# EAGLE design stm32f401_test_module (EAGLE 6.4)
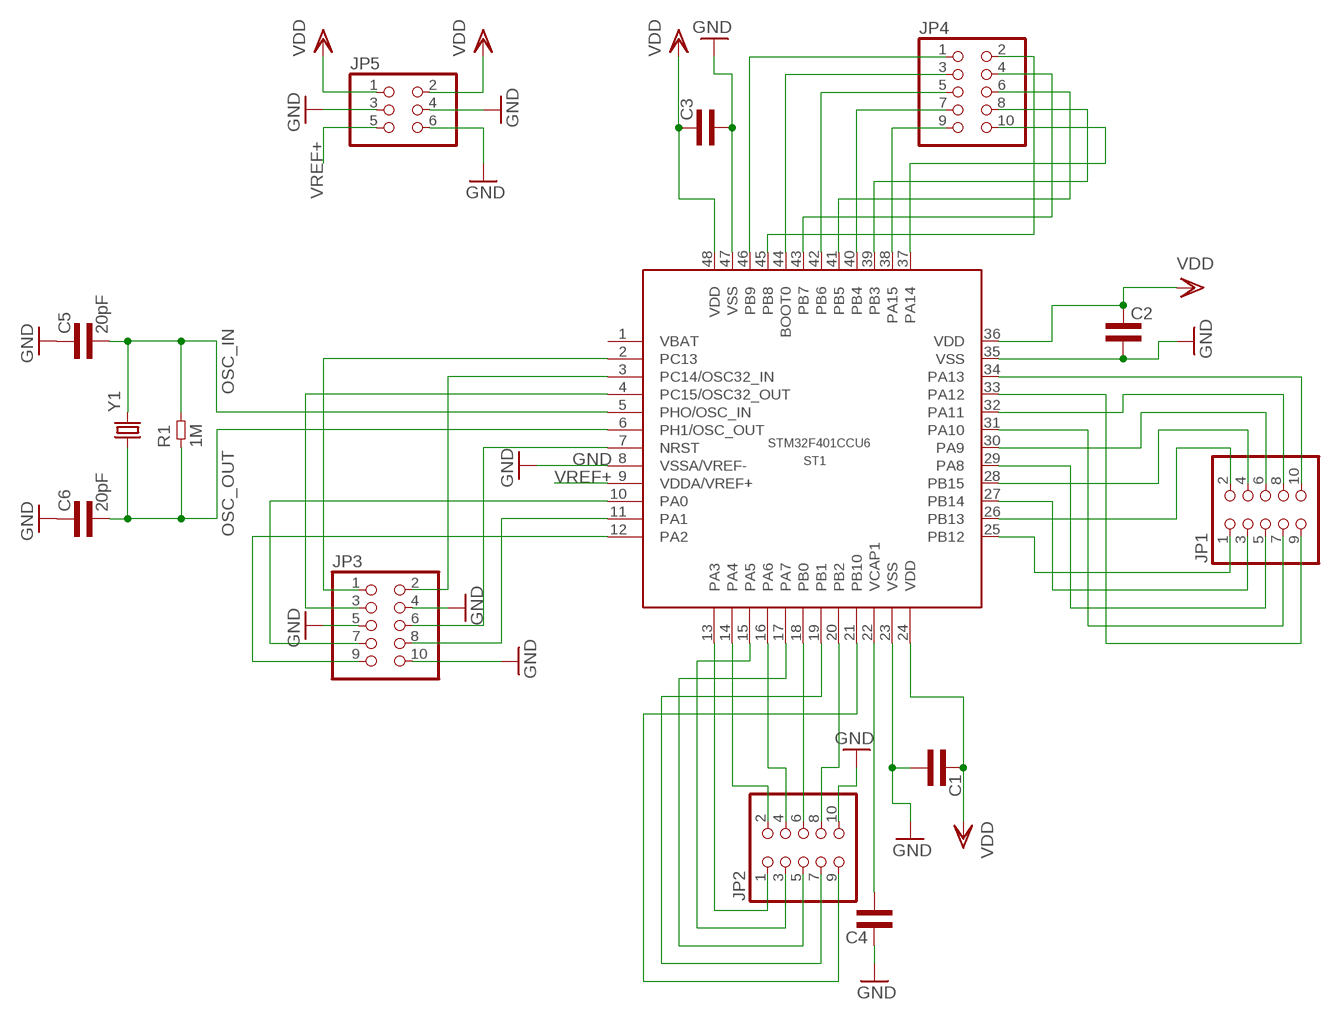
[diagram p0: schematic, sheet 1]

## Parts
C1  CAP0402L3  [0402L3]
C2  CAP0402L3  [0402L3]
C3  CAP0402L3  [0402L3]
C4  CAP0402L3  [0402L3]
C5  20pF  CAP0603L3  [0603L3]
C6  20pF  CAP0603L3  [0603L3]
JP1  PINHD-2X5  [2X05]
JP2  PINHD-2X5  [2X05]
JP3  PINHD-2X5  [2X05]
JP4  PINHD-2X5  [2X05]
JP5  PINHD-2X3  [2X03]
R1  1M  RES0603L3  [0603L3]
ST1  STM32F401CCU6  [UFQFPN48]
Y1  CRYSTALHC49US  [HC49US]

## Nets
GND: C1.P$2 C2.P$2 C3.P$2 C4.P$1 C5.P$1 C6.P$1 JP2.10 JP3.4 JP3.5 JP3.10 JP5.3 JP5.4 JP5.6 ST1.8(VSSA/VREF-) ST1.23(VSS) ST1.35(VSS) ST1.47(VSS)
N$1: JP2.7 ST1.19(PB1)
N$2: JP2.8 ST1.20(PB2)
N$3: JP2.9 ST1.21(PB10)
N$7: C4.P$2 ST1.22(VCAP1)
N$9: JP3.1 ST1.2(PC13)
N$10: JP3.2 ST1.3(PC14/OSC32_IN)
N$11: JP3.3 ST1.4(PC15/OSC32_OUT)
N$14: JP3.6 ST1.7(NRST)
N$15: JP3.7 ST1.10(PA0)
N$16: JP3.8 ST1.11(PA1)
N$17: JP3.9 ST1.12(PA2)
N$18: JP2.1 ST1.13(PA3)
N$19: JP2.2 ST1.14(PA4)
N$20: JP2.3 ST1.15(PA5)
N$21: JP2.4 ST1.16(PA6)
N$22: JP2.5 ST1.17(PA7)
N$23: JP2.6 ST1.18(PB0)
N$24: JP1.1 ST1.25(PB12)
N$25: JP1.2 ST1.26(PB13)
N$26: JP1.3 ST1.27(PB14)
N$27: JP1.4 ST1.28(PB15)
N$28: JP1.5 ST1.29(PA8)
N$29: JP1.6 ST1.30(PA9)
N$30: JP1.7 ST1.31(PA10)
N$31: JP1.8 ST1.32(PA11)
N$32: JP1.9 ST1.33(PA12)
N$33: JP1.10 ST1.34(PA13)
N$34: JP4.1 ST1.46(PB9)
N$35: JP4.2 ST1.45(PB8)
N$36: JP4.3 ST1.44(BOOT0)
N$37: JP4.4 ST1.43(PB7)
N$38: JP4.5 ST1.42(PB6)
N$39: JP4.6 ST1.41(PB5)
N$40: JP4.7 ST1.40(PB4)
N$41: JP4.8 ST1.39(PB3)
N$42: JP4.9 ST1.38(PA15)
N$43: JP4.10 ST1.37(PA14)
OSC_IN: C5.P$2 R1.P$2 ST1.5(PHO/OSC_IN) Y1.2
OSC_OUT: C6.P$2 R1.P$1 ST1.6(PH1/OSC_OUT) Y1.1
VDD: C1.P$1 C2.P$1 C3.P$1 JP5.1 JP5.2 ST1.24(VDD) ST1.36(VDD) ST1.48(VDD)
VREF+: JP5.5 ST1.9(VDDA/VREF+)
Unconnected: ST1.1(VBAT)

## Library data of the parts
C1-C6 = common:CAP
JP1-JP4 = pinhead:PINHD-2X5: PIN HEADER
JP5 = pinhead:PINHD-2X3: PIN HEADER
R1 = common:RES
ST1 = common:STM32F401CCU6
Y1 = SparkFun-FreqCtrl:CRYSTAL: Various standard crystals. Proven footprints. Spark Fun Electronics SKU : COM-00534

## Board
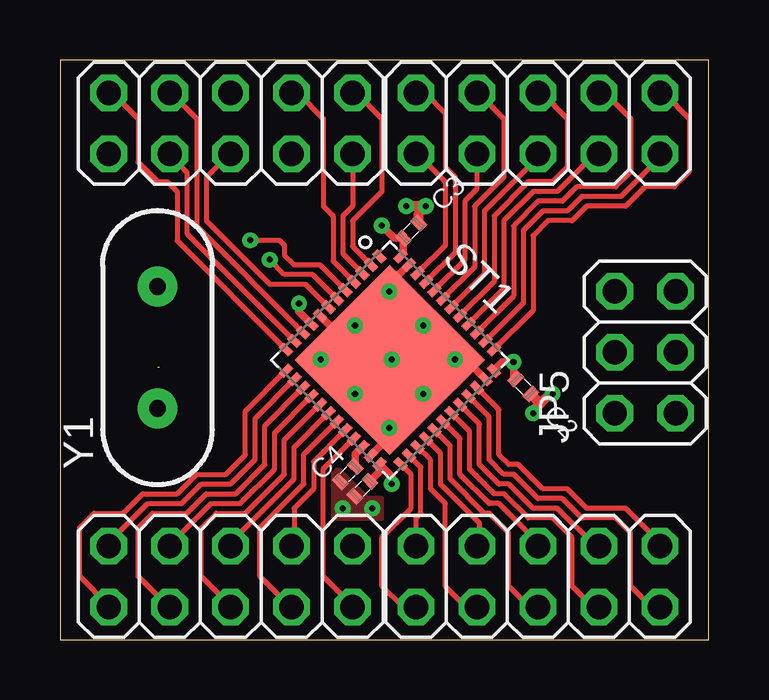
[diagram p1: board, top side]
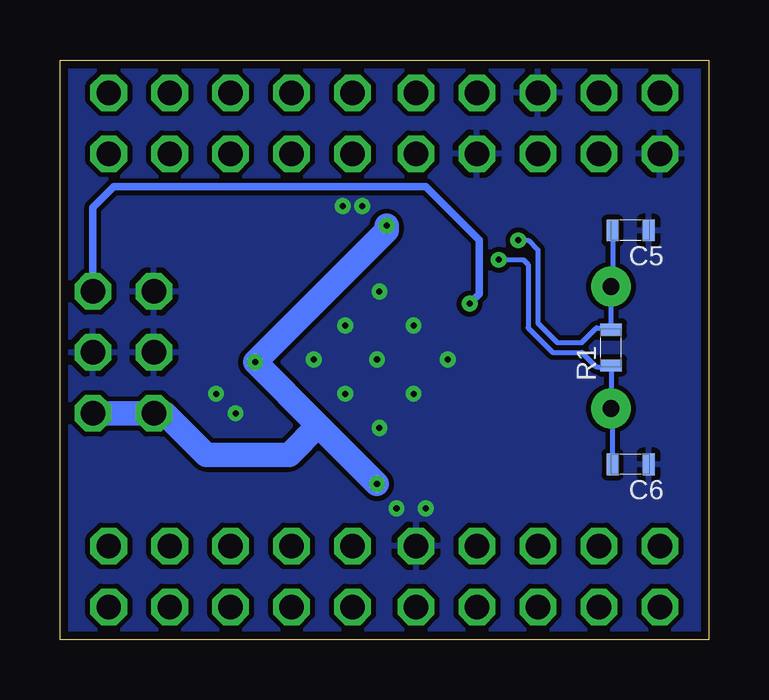
[diagram p2: board, bottom side, seen from below]

Size 27.03 x 24.18 mm. Coordinates in mm from the lower left corner, seen from the top.
Outline: 0,0 27.03,0 27.03,24.18 0,24.18 0,0
Copper layers (1*16): Top 0.035mm / dielectric 1.5mm / Bottom 0.035mm
Design rules "default *": minimum track width 10mil, minimum drill 24mil, track to track 8mil, track to pad 8mil, pad to pad 8mil, via to via 8mil, smd to smd 8mil, copper to edge 13mil, drill to drill 8mil, minimum pad ring 10mil, minimum via ring 8mil, stop-mask expansion 4mil, vias tented up to drill 0mil, thermal gap 10mil

### Footprints (pad centres in the part's own frame; a part is rotated, then mirrored left to right if it is on the bottom)
0402L3 = smd 0.4 x 0.6: P$1 -0.45,0; P$2 0.45,0
0603L3 = smd 0.5 x 0.9: P$1 -0.75,0; P$2 0.75,0
2X05 = drill 1.016 octagon: 1 -5.08,-1.27; 2 -5.08,1.27; 3 -2.54,-1.27; 4 -2.54,1.27; 5 0,-1.27; 6 0,1.27; 7 2.54,-1.27; 8 2.54,1.27; 9 5.08,-1.27; 10 5.08,1.27
2X03 = drill 1.016 octagon: 1 -2.54,-1.27; 2 -2.54,1.27; 3 0,-1.27; 4 0,1.27; 5 2.54,-1.27; 6 2.54,1.27
UFQFPN48 = smd 0.55 x 0.3: 1 -3.375,2.75; 2 -3.375,2.25; 3 -3.375,1.75; 4 -3.375,1.25; 5 -3.375,0.75; 6 -3.375,0.25; 7 -3.375,-0.25; 8 -3.375,-0.75; 9 -3.375,-1.25; 10 -3.375,-1.75; 11 -3.375,-2.25; 12 -3.375,-2.75; 25 3.375,-2.75; 26 3.375,-2.25; 27 3.375,-1.75; 28 3.375,-1.25; 29 3.375,-0.75; 30 3.375,-0.25; 31 3.375,0.25; 32 3.375,0.75; 33 3.375,1.25; 34 3.375,1.75; 35 3.375,2.25; 36 3.375,2.75 | smd 0.3 x 0.55: 13 -2.75,-3.375; 14 -2.25,-3.375; 15 -1.75,-3.375; 16 -1.25,-3.375; 17 -0.75,-3.375; 18 -0.25,-3.375; 19 0.25,-3.375; 20 0.75,-3.375; 21 1.25,-3.375; 22 1.75,-3.375; 23 2.25,-3.375; 24 2.75,-3.375; 37 2.75,3.375; 38 2.25,3.375; 39 1.75,3.375; 40 1.25,3.375; 41 0.75,3.375; 42 0.25,3.375; 43 -0.25,3.375; 44 -0.75,3.375; 45 -1.25,3.375; 46 -1.75,3.375; 47 -2.25,3.375; 48 -2.75,3.375 | smd 5.6 x 5.6: TP 0,0
HC49US = drill 0.7 pad 1.651: 1 -2.54,0; 2 2.54,0

### Placement (x,y rotation side)
C1  12.6,6.3 225 top
C2  19.3,10.57 315 top
C3  14.63,17.07 45 top
C4  11.99,6.91 45 top
C5  3.25,17.07 180 bottom
C6  3.25,7.32 180 bottom
JP1  19.91,2.64 0 top
JP2  7.11,2.64 0 top
JP3  7.11,21.54 180 top
JP4  19.91,21.54 0 top
JP5  24.38,11.99 90 top
R1  4.06,12.19 90 bottom
ST1  13.75,11.67 315 top
Y1  4.06,12.19 90 top

### Tracks (layer width: path | path; a pad name or v marks a point on that pad's centre or on a via)
GND  (via drill 0.25)
  Top 0.305: v12.29,13.11 11.25,13.11 ST1.8 | v13.72,8.84 13.72,8.45 ST1.23 | v16.46,11.68 16.91,11.68 ST1.35 | v13.72,14.53 13.72,14.82 ST1.47
  Top 0.406: v14.43,18.08 v15.24,18.08 14.95,17.79 C3.P$2 | v19.71,9.45 19.71,9.55 20.02,9.86 | 20.02,9.86 20.52,10.36 | C2.P$2 | C2.P$2 20.02,9.86
  other vias: 10.87,11.68 13.82,11.68 12.29,10.26 15.14,13.11 15.14,10.26 20.52,10.26 11.79,5.49 13,5.49
  pour Bottom: 0.41,23.77 26.62,23.77 26.62,0.41 0.41,0.41
  pour Top (no thermals): 11.38,6.91 11.38,5.08 13.41,5.08 13.41,5.89 12.8,5.89 11.58,7.11
N$1
  Top 0.203: JP2.7 9.6,1.37 8.33,2.64 8.33,4.67 10.16,6.5 10.16,7.73 ST1.19
N$2
  Top 0.203: 9.65,3.96 JP2.8 9.75,4.01 9.75,5.49 10.57,6.3 10.57,7.43 ST1.20
N$3
  Top 0.203: JP2.9 12.19,1.42 10.97,2.64 10.97,7.13 ST1.21
N$7
  Top 0.305: C4.P$2 12.31,7.75 ST1.22
N$9
  Top 0.203: JP3.1 12.34,22.81 13.41,21.74 13.41,18.69 12.19,17.48 12.19,16.4 ST1.2
N$10
  Top 0.203: JP3.2 12.19,18.08 11.79,17.68 11.79,16.1 ST1.3
N$11
  Top 0.203: JP3.3 9.91,22.81 10.97,21.74 10.97,18.08 11.38,17.68 11.38,15.8 ST1.4
N$14
  Top 0.203: JP3.6 7.06,20.27 6.1,19.3 6.1,17.48 8.74,14.83 10.23,14.83 ST1.7
N$15
  Top 0.203: JP3.7 4.62,22.81 5.69,21.74 5.69,17.25 ST1.10
N$16
  Top 0.203: JP3.8 4.57,20.22 5.28,19.51 5.28,16.95 ST1.11
N$17
  Top 0.203: JP3.9 2.18,22.81 3.25,21.74 3.25,19.91 4.06,19.1 4.47,19.1 4.88,18.69 4.88,16.65 ST1.12
N$18
  Top 0.203: JP2.1 2.03,1.42 0.81,2.64 0.81,4.67 1.42,5.28 2.64,5.28 3.45,6.1 4.88,6.1 5.69,6.91 6.91,6.91 7.72,7.72 7.72,9.53 ST1.13
N$19
  Top 0.203: JP2.2 2.03,4.06 3.66,5.69 5.08,5.69 5.89,6.5 7.11,6.5 8.13,7.52 8.13,9.23 ST1.14
N$20
  Top 0.203: JP2.3 4.52,1.37 3.25,2.64 3.25,4.67 3.86,5.28 5.28,5.28 6.1,6.1 7.32,6.1 8.53,7.32 8.53,8.93 ST1.15
N$21
  Top 0.203: JP2.4 4.57,3.96 6.3,5.69 7.52,5.69 8.94,7.11 8.94,8.63 ST1.16
N$22
  Top 0.203: JP2.5 7.11,1.42 5.89,2.64 5.89,4.67 6.5,5.28 7.72,5.28 9.35,6.91 9.35,8.33 ST1.17
N$23
  Top 0.203: JP2.6 7.11,4.06 9.75,6.71 9.75,8.03 ST1.18
N$24
  Top 0.203: JP1.1 14.28,1.37 13.41,2.24 13.41,4.27 14.63,5.49 14.63,6.89 ST1.25
N$25
  Top 0.203: JP1.2 14.83,5.08 15.04,5.28 15.04,7.19 ST1.26
N$26
  Top 0.203: JP1.3 16.92,1.37 16.05,2.24 16.05,5.69 15.44,6.3 15.44,7.49 ST1.27
N$27
  Top 0.203: 17.37,3.96 JP1.4 17.48,4.01 17.48,4.88 15.85,6.5 15.85,7.8 ST1.28
N$28
  Top 0.203: JP1.5 19.56,1.37 18.69,2.24 18.69,4.47 17.88,5.28 17.68,5.28 16.26,6.71 16.26,8.1 ST1.29
N$29
  Top 0.203: JP1.6 19.91,4.06 18.29,5.69 17.88,5.69 16.66,6.91 16.66,8.4 ST1.30
N$30
  Top 0.203: JP1.7 22.2,1.37 21.34,2.24 21.34,4.27 20.52,5.08 19.51,5.08 18.49,6.1 18.09,6.1 17.07,7.11 17.07,8.7 ST1.31
N$31
  Top 0.203: JP1.8 22.3,3.91 20.73,5.49 19.71,5.49 18.69,6.5 18.29,6.5 17.48,7.32 17.48,9 ST1.32
N$32
  Top 0.203: JP1.9 24.64,1.37 23.77,2.24 23.77,4.47 23.17,5.08 21.74,5.08 20.93,5.89 19.91,5.89 18.9,6.91 18.49,6.91 17.88,7.52 17.88,9.3 ST1.33
N$33
  Top 0.203: JP1.10 24.99,4.06 23.57,5.49 21.95,5.49 21.13,6.3 20.12,6.3 19.1,7.32 18.69,7.32 18.29,7.72 18.29,9.6 ST1.34
N$34
  Top 0.203: JP4.1 14.83,20.32 16.05,19.1 16.05,16.45 ST1.46
N$35
  Top 0.203: JP4.2 15.19,22.81 16.05,21.95 16.05,19.71 16.46,19.3 16.46,16.15 ST1.45
N$36
  Top 0.203: JP4.3 17.37,18.8 16.87,18.29 16.87,15.85 ST1.44
N$37
  Top 0.203: JP4.4 17.42,22.81 18.49,21.74 18.49,19.3 17.27,18.08 17.27,15.55 ST1.43
N$38
  Top 0.203: JP4.5 19.91,20.12 17.68,17.88 17.68,15.25 ST1.42
N$39
  Top 0.203: JP4.6 20.07,22.81 21.13,21.74 21.13,19.71 20.52,19.1 19.51,19.1 18.09,17.68 18.09,14.95 ST1.41
N$40
  Top 0.203: JP4.7 22.3,20.27 20.73,18.69 19.71,18.69 18.49,17.48 18.49,14.64 ST1.40
N$41
  Top 0.203: JP4.8 22.71,22.81 23.77,21.74 23.77,19.51 23.17,18.9 21.54,18.9 20.93,18.29 19.91,18.29 18.9,17.27 18.9,14.34 ST1.39
N$42
  Top 0.203: JP4.9 24.99,20.12 23.37,18.49 21.74,18.49 21.13,17.88 20.12,17.88 19.3,17.07 19.3,14.04 ST1.38
N$43
  Top 0.203: JP4.10 25.15,22.81 26.21,21.74 26.21,19.51 25.6,18.9 24.38,18.9 23.57,18.08 21.95,18.08 21.34,17.48 20.32,17.48 19.71,16.87 19.71,13.74 ST1.37
OSC_IN  (via drill 0.25)
  Top 0.203: ST1.5 10.83,15.65 9.75,15.65 9.35,16.05 9.35,16.46 9.14,16.66 v7.93,16.66
  Bottom 0.203: C5.P$2 4,14.79 Y1.2 R1.P$2 4.13,13 4.67,13 5.28,12.4 6.3,12.4 7.11,13.21 7.11,16.26 7.52,16.66 v7.93,16.66
OSC_OUT  (via drill 0.25)  (1 unrouted)
  Top 0.203: ST1.6 10.53,15.24 9.35,15.24 v8.74,15.85
  Bottom 0.203: C6.P$2 4,9.59 Y1.1 4.06,11.38 | v8.74,15.85 7.72,15.85 7.52,15.65 7.52,13 6.5,11.99 5.28,11.99 4.67,11.38 4.13,11.38 R1.P$1
VDD  (via drill 0.25)
  Top 0.305: C1.P$1 13.3,7 ST1.24 13.82,6.82 v13.82,6.5 | ST1.48 14.31,16.12 C3.P$1 13.93,16.75 v13.41,17.27 | C2.P$1 18.9,10.97 v18.9,11.58 18.43,11.58 ST1.36
  Bottom 1.016: 16.26,8.94 v18.9,11.58 13.41,17.07 v13.41,17.27 | 16.26,8.94 v13.82,6.5 | JP5.1 JP5.2 22.66,9.45 20.93,7.72 17.48,7.72 16.26,8.94
VREF+  (via drill 0.25)
  Top 0.305: v9.96,14.02 9.96,13.69 ST1.9
  Bottom 0.305: JP5.5 25.65,18.03 24.79,18.9 11.79,18.9 9.55,16.66 9.55,14.43 v9.96,14.02